# EAGLE design 401_led_one (EAGLE 7.6.0)
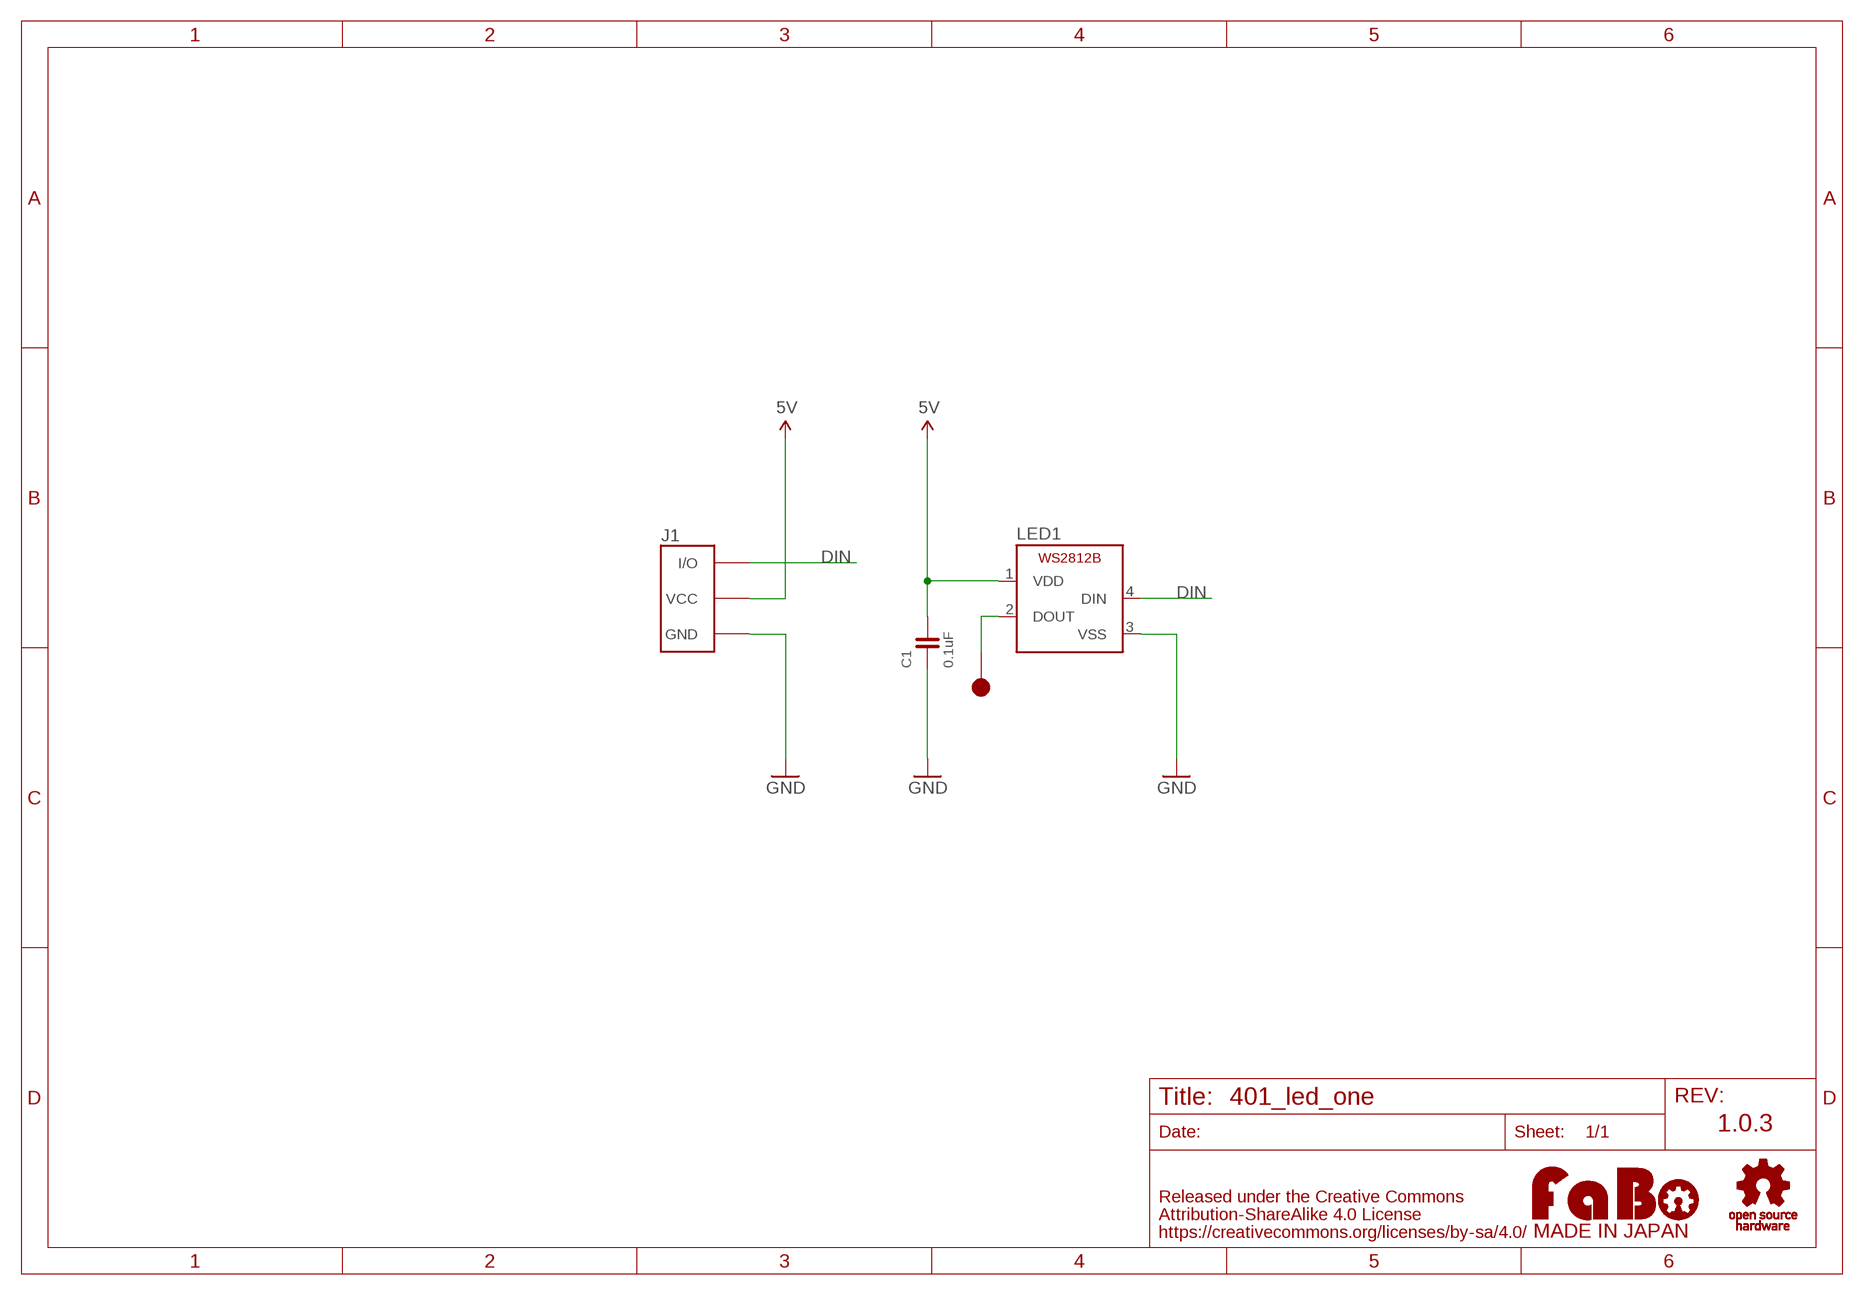
[diagram p0: schematic, sheet 1]

## Parts
C1  0.1uF  CAPACITOR-0603  [0603]
J1  FABO_BRICK_3PIN  [FABO_BRICK_3PIN]
LED1  WS2812B  [WS2812B]
TP1  TP-10  [TP-10]
U$2  LOGO_OSHW-M_BOTTOM  [LOGO_OSHW_M_BOTTOM]
U$3  LOGO_FABO-M  [LOGO_FABO_MS]

## Nets
5V: C1.2 J1.VCC LED1.1(VDD)
DIN: J1.I/O LED1.4(DIN)
GND: C1.1 J1.GND LED1.3(VSS)
N$1: LED1.2(DOUT) TP1.1

## Notes on the sheet
- 1.0.3

## Library data of the parts
C1 = FaBo-Capacitor:CAPACITOR: CAPACITOR
J1 = FaBo-Template:FABO_BRICK_3PIN: FaBo Brick 3pin
LED1 = FaBo-LED:WS2812B
TP1 = FaBo-Supply:TP
U$2 = FaBo-etc:LOGO_OSHW
U$3 = FaBo-etc:LOGO_FABO

## Board
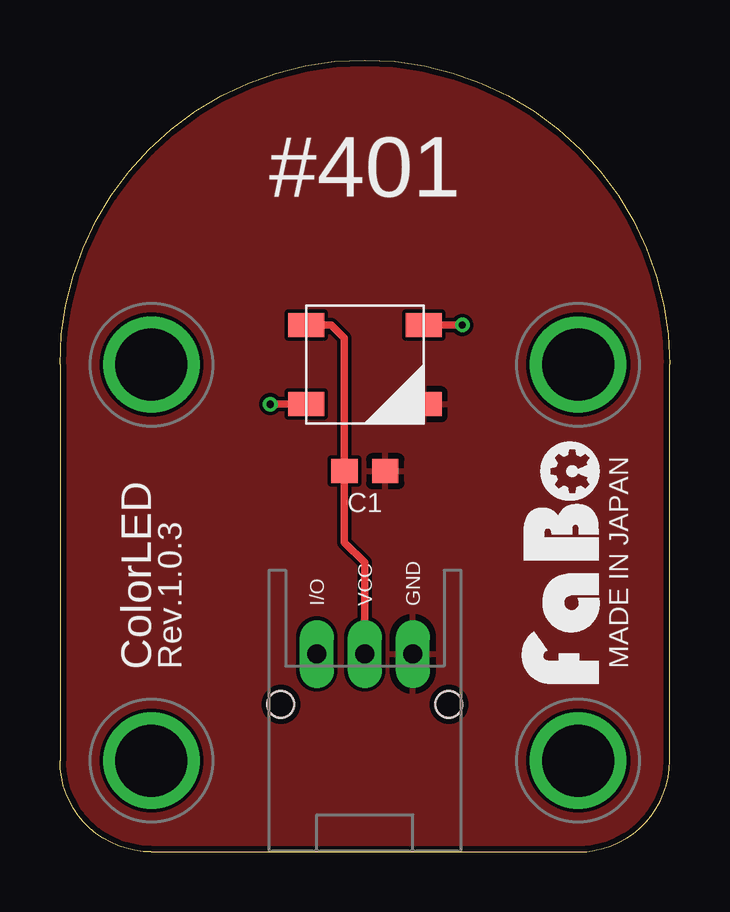
[diagram p1: board, top side]
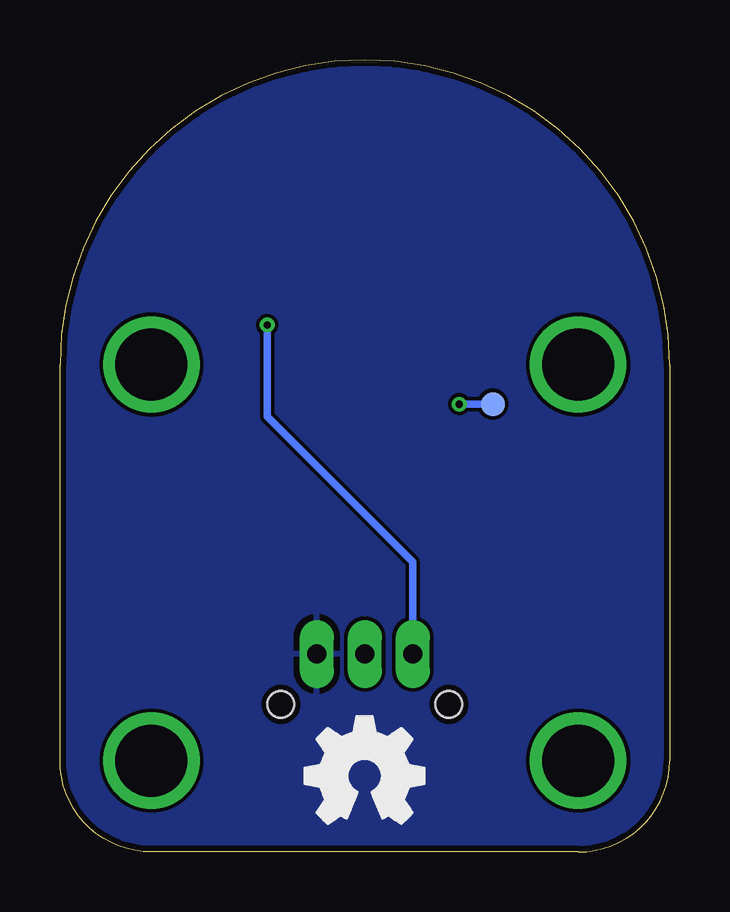
[diagram p2: board, bottom side, seen from below]

Size 25.4 x 33.02 mm. Coordinates in mm from the lower left corner, seen from the top.
Copper layers (1*16): Top 0.035mm / dielectric 1.5mm / Bottom 0.035mm
Design rules "SeeedStudio_2layer_DRU_no_angle_20140221": minimum track width 6mil, minimum drill 12mil, track to track 6mil, track to pad 6mil, pad to pad 6mil, via to via 6mil, smd to smd 0mil, copper to edge 10mil, drill to drill 10mil, minimum pad ring 10mil, minimum via ring 6mil, stop-mask expansion 2mil, vias tented up to drill 100mil, thermal gap 10mil

### Footprints (pad centres in the part's own frame; a part is rotated, then mirrored left to right if it is on the bottom)
0603 = smd 1.1 x 1: 1 -0.85,0; 2 0.85,0
FABO_BRICK_3PIN = drill 0.8 pad 1.422 long: GND 2,-8.255; I/O -2,-8.255; VCC 0,-8.255 | drill 3 pad 3.81: P$1 -8.89,3.81; P$2 8.89,3.81; P$3 -8.89,-12.7; P$4 8.89,-12.7 | hole 1.1: -3.5,-10.355; 3.5,-10.355
WS2812B = smd 1.5 x 1: 1 -2.45,1.65; 2 -2.45,-1.65; 3 2.45,-1.65; 4 2.45,1.65
TP-10 = smd 1 x 1: 1 0,0

### Placement (x,y rotation side)
C1  12.7,15.88 180 top
J1  12.7,16.51 0 top
LED1  12.7,20.32 0 top
TP1  7.37,18.67 0 bottom
U$2  12.7,3.17 0 top
U$3  22.86,12.06 90 top

### Tracks (layer width: path | path; a pad name or v marks a point on that pad's centre or on a via)
5V
  Top 0.305: J1.VCC 12.7,12.06 11.85,12.91 C1.2 11.85,21.42 11.3,21.97 LED1.1
DIN  (via drill 0.3)
  Top 0.305: LED1.4 v16.76,21.97
  Bottom 0.305: J1.I/O 10.7,12.1 16.76,18.16 v16.76,21.97
GND
  pour Bottom: 0,0 25.4,0 25.4,33.02 0,33.02
  pour Top: 0,0 25.4,0 25.4,33.02 0,33.02
N$1  (via drill 0.3)
  Top 0.305: LED1.2 8.89,18.67 v8.76,18.67
  Bottom 0.305: v8.76,18.67 TP1.1

### Text on the board
tPlace: #401 | MADE IN JAPAN | ColorLED | Rev.1.0.3